# Altium project HumFlex1.PrjPcb
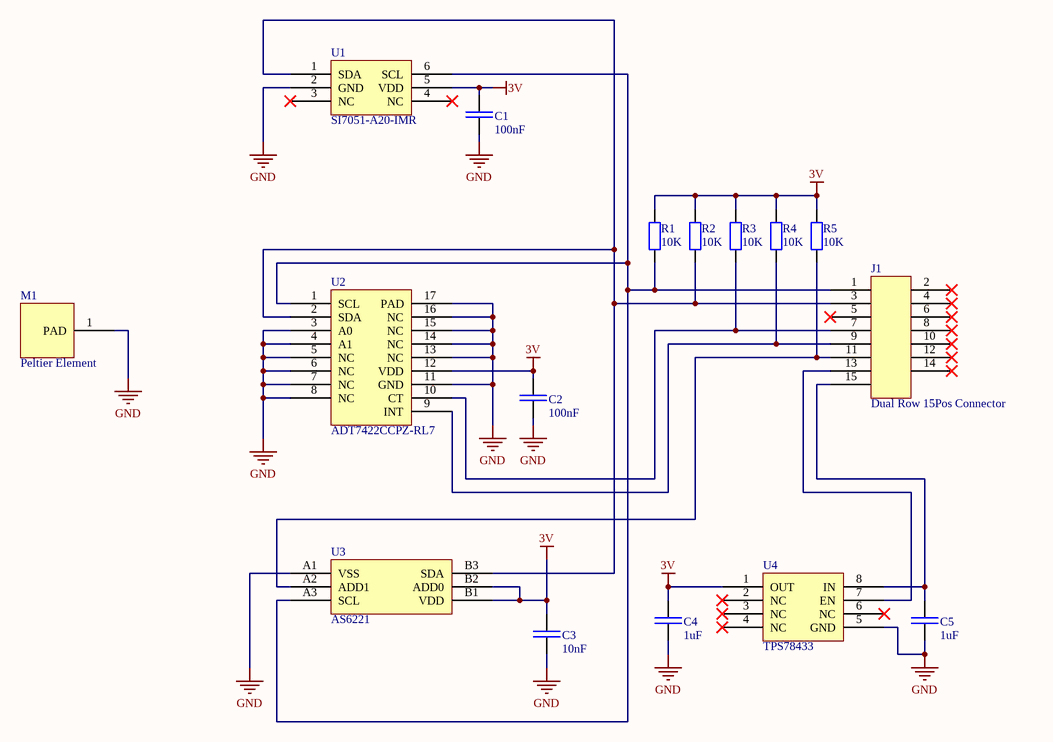
[diagram p0: HumFlex1.SchDoc]
1 sheet, 16 parts. Net scope: global (net labels, ports and power ports of the same name join across sheets).
Board files: HumFlex1.PcbDoc, HumSolid1.PcbDoc

## Sheet HumFlex1.SchDoc
size A4; SheetNumber: 1; SheetTotal: 1

### Parts
C1  100nF  [CAP_SM0603_YAGEOCC2_N]
C2  100nF  [CAP_SM0603_YAGEOCC2_N]
C3  10nF  [CAP_SM0402_YAGEOCC2_N]
C4  1uF  [CAP_SM0805_YAGEOCC2_N]
C5  1uF  [CAP_SM0805_YAGEOCC2_N]
J1  Dual Row 15Pos Connector  [AYF331535_FPC]
M1  Peltier Element  [PeltierElement]
R1  10K  [RES_SM0603_YAGEORC_N]
R2  10K  [RES_SM0603_YAGEORC_N]
R3  10K  [RES_SM0603_YAGEORC_N]
R4  10K  [RES_SM0603_YAGEORC_N]
R5  10K  [RES_SM0603_YAGEORC_N]
U1  SI7051-A20-IMR  [SI7050/1/2/3/4/5]
U2  ADT7422CCPZ-RL7  [ADT7422_QFN]
U3  AS6221  [AS6221_BGA]
U4  TPS78433  [TPS784xxxQDRBRQ1_SON]

### Nets
3V: C1.2 C2.2 C3.1 C4.2 R1.2 R2.2 R3.2 R4.2 R5.2 U1.5(VDD) U2.12(VDD) U3.B1(VDD) U3.B2(ADD0) U4.1(OUT)
GND: C1.1 C2.1 C3.2 C4.1 C5.1 M1.1(PAD) U1.2(GND) U2.3(A0) U2.4(A1) U2.5(NC) U2.6(NC) U2.7(NC) U2.8(NC) U2.11(GND) U2.13(NC) U2.14(NC) U2.15(NC) U2.16(NC) U2.17(PAD) U3.A1(VSS) U4.5(GND)
NetC5_2: C5.2 J1.15 U4.8(IN)
NetJ1_1: J1.1 R1.1 U1.6(SCL) U2.1(SCL) U3.A3(SCL)
NetJ1_3: J1.3 R2.1 U1.1(SDA) U2.2(SDA) U3.B3(SDA)
NetJ1_7: J1.7 R3.1 U2.10(CT)
NetJ1_9: J1.9 R4.1 U2.9(INT)
NetJ1_11: J1.11 R5.1 U3.A2(ADD1)
NetJ1_13: J1.13 U4.7(EN)

Not connected (* = marked no-connect by the designer): J1 2* 4* 5* 6* 8* 10* 12* 14*; U1 3(NC)* 4(NC)*; U4 2(NC)* 3(NC)* 4(NC)* 6(NC)*

### Library data of the parts
C1 C2 = CC0603KRX7R9BB104: CAP 100nF SM0603 X7R 50V YAGEO CC2; Tolerance (%): 10; Voltage Rating (Volts): 50; Value: 100nF; Category: Capacitor; Manufacturer: Yageo; Manufacturer Part Number: CC0603KRX7R9BB104; Package: 0603; Supplier Part Number 1: 1362556; Supplier 1: Farnell; ComponentLink1URL: http://www.yageo.com; ComponentLink1Description: Manufacturer Website; Supplier 2: Digi-Key; Supplier Part Number 2: 311-1344-1-ND
C3 = CC0402KRX7R9BB103: CAP 10nF SM0402 X7R 50V YAGEO CC2; Manufacturer Part Number: CC0603KRX7R9BB103; Tolerance (%): 10; Voltage Rating (Volts): 50; Category: Capacitor; Manufacturer: Yageo; Package: 0603; Value: 10nF; Supplier Part Number 1: 3369167; Supplier 1: Farnell; ComponentLink1URL: http://www.yageo.com; ComponentLink1Description: Manufacturer Website; Supplier 2: Mouser; Supplier Part Number 2: 603-CC402KRX7R9BB103; Supplier 3: Digi-Key; Supplier Part Number 3: 311-1349-1-ND
C4 C5 = CC0805KKX7R8BB105: CAP 1uF SM0805 X7R 25V YAGEO CC2; Tolerance (%): 10; Voltage Rating (Volts): 25; Value: 1uF; Category: Capacitor; Manufacturer: Yageo; Manufacturer Part Number: CC0805KKX7R8BB105; Package: 0805; Supplier Part Number 1: 1458903; Supplier 1: Farnell; ComponentLink1URL: http://www.yageo.com; ComponentLink1Description: Manufacturer Website; Supplier 2: Digi-Key; Supplier Part Number 2: 311-1456-1-ND
J1 = Connector_15_DualRow
M1 = PeltierElement: Peltier element 40mm x 40mm
R1-R5 = RC0603FR-0710KL: RES 10K SM0603 YAGEO RC_L; Power (Watts): 0.1; Resistance (Ohms): 10000; Tolerance (%): 1; Value: 10K; Category: Resistor; Manufacturer: Yageo; Manufacturer Part Number: RC0603FR-0710KL; Package: 0603; Supplier Part Number 1: 9238603; Supplier 1: Farnell; ComponentLink1URL: http://www.yageo.com; ComponentLink1Description: Manufacturer Website; Supplier 2: Digi-Key; Supplier Part Number 2: 311-10.0KHRCT-ND
U1 = SI7051-A20-IMR: Si7051-A20 Temperature Sensor ±0.1°C maximum accuracy, Digital I2C, -40°C ~ 125°C 14b 6-DFN (3x3); Supplier 1: Farnell; Supplier Part Number 1: 3265013RL; Supplier 2: Mouser; Supplier Part Number 2: 634-SI7051-A20-IMR; Supplier 3: Digi-Key; Supplier Part Number 3: 336-4764-1-ND
U2 = ADT7422CCPZ-RL7: ADT7422 Temperature Sensor, ±0.1°C Accuracy, 16b, Digital I2C / -40°C bis 125°C 16-LFCSP-WQ (4x4); Supplier 1: Mouser; Supplier Part Number 1: 584-ADT7422CCPZ-RL7; Supplier 2: Digi-Key; Supplier Part Number 2: 505-ADT7422CCPZ-RL7CT-ND
U3 = AS6221-AWLT-S: AS6221 Temperature Sensor Digital -40°C ~ 125°C 16b 6-WLCSP (1.5x1.03); Supplier 1: Mouser; Supplier Part Number 1: 985-AS6221-AWLT-S; Supplier 2: Digi-Key; Supplier Part Number 2: 4991-AS6221-AWLT-SCT-ND
U4 = TPS78433QWDRBRQ1: TPS78433-Q1 3.3V, 300-mA, High-PSRR Low-Dropout Voltage Regulator With High Accuracy and Enable,  8-SON (3x3); Supplier 1: Mouser; Supplier Part Number 1: 595-TPS78433QWDRBRQ1; Supplier 2: Digi-Key; Supplier Part Number 2: 296-TPS78433QWDRBRQ1CT-ND